# EAGLE schematic esp32_main_card (EAGLE 9.6.2)
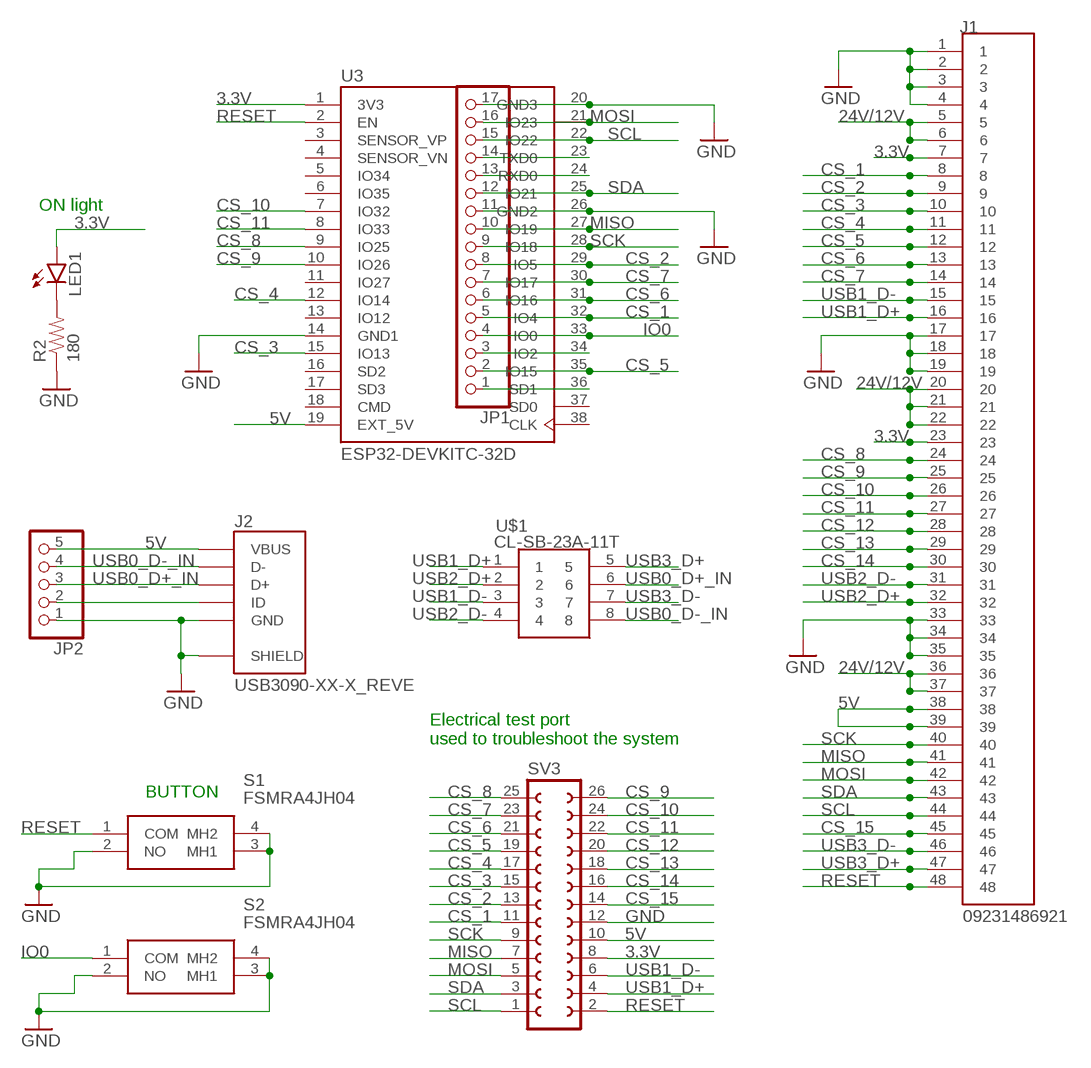
[diagram p0: schematic, sheet 1]

## Parts
J1  09231486921  [HARTING_09231486921]
J2  USB3090-XX-X_REVE  [GCT_USB3090-XX-X_REVE]
JP1  PINHD-1X17  [1X17]
JP2  PINHD-1X5  [1X05]
LED1  LED3MM  [LED3MM]
R2  180  RESISTOR0805-RES  [0805]
S1  FSMRA4JH04  [FSMRA4JH04]
S2  FSMRA4JH04  [FSMRA4JH04]
SV3  FE13-2W  [FE13-2W]
U3  ESP32-DEVKITC-32D  [MODULE_ESP32-DEVKITC-32D]
U$1  CL-SB-23A-11T  [CL-SB-23A-11T]

## Nets
3.3V: J1.7 J1.23 LED1.A SV3.8 U3.1(3V3)
5V: J1.38 J1.39 J2.1(VBUS) JP2.5 SV3.10 U3.19(EXT_5V)
24V/12V [POWER]: J1.5 J1.6 J1.20 J1.21 J1.22 J1.36 J1.37
CS_1: J1.8 JP1.5 SV3.11 U3.32(IO4)
CS_2: J1.9 JP1.8 SV3.13 U3.29(IO5)
CS_3: J1.10 SV3.15 U3.15(IO13)
CS_4: J1.11 SV3.17 U3.12(IO14)
CS_5: J1.12 JP1.2 SV3.19 U3.35(IO15)
CS_6: J1.13 JP1.6 SV3.21 U3.31(IO16)
CS_7: J1.14 JP1.7 SV3.23 U3.30(IO17)
CS_8: J1.24 SV3.25 U3.9(IO25)
CS_9: J1.25 SV3.26 U3.10(IO26)
CS_10: J1.26 SV3.24 U3.7(IO32)
CS_11: J1.27 SV3.22 U3.8(IO33)
CS_12: J1.28 SV3.20
CS_13: J1.29 SV3.18
CS_14: J1.30 SV3.16
CS_15: J1.45 SV3.14
GND: J1.1 J1.2 J1.3 J1.4 J1.17 J1.18 J1.19 J1.33 J1.34 J1.35 J2.5(GND) J2.6(SHIELD) J2.7(SHIELD) J2.8(SHIELD) J2.9(SHIELD) JP1.11 JP2.1 R2.1 S1.2(NO) S1.3(MH1) S1.4(MH2) S2.2(NO) S2.3(MH1) S2.4(MH2) SV3.12 U3.14(GND1) U3.26(GND2)
IO0: JP1.4 S2.1(COM) U3.33(IO0)
MISO: J1.41 JP1.10 SV3.7 U3.27(IO19)
MOSI: J1.42 JP1.16 SV3.5 U3.21(IO23)
N$1: J2.4(ID) JP2.2
N$2: JP1.17 U3.20(GND3) ; supply symbol labelled GND
N$3: JP1.14 U3.23(TXD0)
N$4: JP1.13 U3.24(RXD0)
N$6: JP1.3 U3.34(IO2)
N$7: JP1.1 U3.36(SD1)
N$9: LED1.K(C) R2.2
RESET: J1.48 S1.1(COM) SV3.2 U3.2(EN)
SCK: J1.40 JP1.9 SV3.9 U3.28(IO18)
SCL: J1.44 JP1.15 SV3.1 U3.22(IO22)
SDA: J1.43 JP1.12 SV3.3 U3.25(IO21)
USB0_D+_IN: J2.3(D+) JP2.3 U$1.6
USB0_D-_IN: J2.2(D-) JP2.4 U$1.8
USB1_D+: J1.16 SV3.4 U$1.1
USB1_D-: J1.15 SV3.6 U$1.3
USB2_D+: J1.32 U$1.2
USB2_D-: J1.31 U$1.4
USB3_D+: J1.47 U$1.5
USB3_D-: J1.46 U$1.7
Unconnected: U3.3(SENSOR_VP) U3.4(SENSOR_VN) U3.5(IO34) U3.6(IO35) U3.11(IO27) U3.13(IO12) U3.16(SD2) U3.17(SD3) U3.18(CMD) U3.37(SD0) U3.38(CLK)

## Notes on the sheet
- ON light
- Electrical test port
  used to troubleshoot the system
- BUTTON

## Library data of the parts
J1 = din41612_48_pin_board:09231486921: Check prices <https://pricing.snapeda.com/parts/8-1393644-0/TE%20Connectivity/view-part?ref=eda>; MANUFACTURER-PART-NUMBER: 09231486921; PACKAGE: None
J2 = USB3090-XX-X_REVE:USB3090-XX-X_REVE: Micro USB Receptacle, Type AB, SMT, R/A, Bottom Mount, w/out Peg, w/outer shell stakes Check prices <https://pricing.snapeda.com/parts/USB3090-30-A/Global%20Connector%20Technology/view-part?ref=eda>; MANUFACTURER-PART-NUMBER: USB3090-30-A; PACKAGE: None; SIMILAR-COMPONENTS: MCR-B-S-RA-SMT-CS5A-NF-T/R
JP1 = pinhead:PINHD-1X17: PIN HEADER; MANUFACTURER-PART-NUMBER: SLW-117-01-T-S; PACKAGE: 2.54 mm header; SIMILAR-COMPONENTS: https://www.adafruit.com/product/3008
JP2 = pinhead:PINHD-1X5: PIN HEADER
LED1 = led:LED: LED OSRAM: - CHIPLED LG R971, LG N971, LY N971, LG Q971, LY Q971, LO R971, LY R971 LH N974, LH R974 LS Q976, LO Q976, LY Q976 LO Q996 - Hyper CHIPLED LW Q18S LB Q993, LB Q99A, LB R99A - SideLED LS A670, LO A670, LY A670, LG A670, LP A670 LB A673, LV A673, LT A673, LW A673 LH A674 LY A675 LS A676, LA A676, LO A676, LY A676, LW A676 LS A679, LY A679, LG A679 - Hyper Micro SIDELED® LS Y876, LA Y876, LO Y876, LY Y876 LT Y87S - SmartLED LW L88C, LW L88S LB L89C, LB L89S, LG L890 LS L89K, LO L89K, LY L89K LS L896, LA L896, LO L896, LY L896 - TOPLED LS T670, LO T670, LY T670, LG T670, LP T670 LSG T670, LSP T670, LSY T670, LOP T670, LYG T670 LG T671, LOG T671, LSG T671 LB T673, LV T673, LT T673, LW T673 LH T674 LS T676, LA T676, LO T676, LY T676, LB T676, LH T676, LSB T676, LW T676 LB T67C, LV T67C, LT T67C, LS T67K, LO T67K, LY T67K, LW E67C LS E67B, LA E67B, LO E67B, LY E67B, LB E67C, LV E67C, LT E67C LW T67C LS T679, LY T679, LG T679 LS T770, LO T770, LY T770, LG T770, LP T770 LB T773, LV T773, LT T773, LW T773 LH T774 LS E675, LA E675, LY E675, LS T675 LS T776, LA T776, LO T776, LY T776, LB T776 LHGB T686 LT T68C, LB T68C - Hyper Mini TOPLED® LB M676 - Mini TOPLED Santana® LG M470 LS M47K, LO M47K, LY M47K Source: http://www.osram.convergy.de LUXEON: - LUMILED® LXK2-PW12-R00, LXK2-PW12-S00, LXK2-PW14-U00, LXK2-PW14-V00 LXK2-PM12-R00, LXK2-PM12-S00, LXK2-PM14-U00 LXK2-PE12-Q00, LXK2-PE12-R00, LXK2-PE12-S00, LXK2-PE14-T00, LXK2-PE14-U00 LXK2-PB12-K00, LXK2-PB12-L00, LXK2-PB12-M00, LXK2-PB14-N00, LXK2-PB14-P00, LXK2-PB14-Q00 LXK2-PR12-L00, LXK2-PR12-M00, LXK2-PR14-Q00, LXK2-PR14-R00 LXK2-PD12-Q00, LXK2-PD12-R00, LXK2-PD12-S00 LXK2-PH12-R00, LXK2-PH12-S00 LXK2-PL12-P00, LXK2-PL12-Q00, LXK2-PL12-R00 Source: www.luxeon.com KINGBRIGHT: KA-3528ASYC Source: www.kingbright.com; MANUFACTURER-PART-NUMBER: Generic green 3mm LED; PACKAGE: none
R2 = SparkFun-Passives:RESISTOR: Resistor Basic schematic elements and footprints for 0603, 1206, and PTH resistors.; MANUFACTURER-PART-NUMBER: Generic; PACKAGE: 0805; SIMILAR-COMPONENTS: Generic 0805 resistors
S1 S2 = FSMRA4JH04:FSMRA4JH04: Tactile Switch Through Hole Source: Datasheet <http://www.te.com/commerce/DocumentDelivery/DDEController?Action=showdoc&DocId=Customer Drawing1825027G4pdfEnglishENG_CD_1825027_G4.pdf1-1825027-1> Check prices <https://pricing.snapeda.com/parts/FSMRA4JH04/TE%20Connectivity/view-part?ref=eda>; MANUFACTURER-PART-NUMBER: FSMRA4JH04; PACKAGE: None
SV3 = con-lsta:FE13-2W: FEMALE HEADER; MANUFACTURER-PART-NUMBER: generic 13x2 right angle header, male or female; PACKAGE: 13x2 2.54mm header
U3 = ESP32-DEVKITC-32D:ESP32-DEVKITC-32D: Eval Board For Esp-Wroom-32 Check prices <https://pricing.snapeda.com/search/part/ESP32-DEVKITC-32D/?ref=eda>; MANUFACTURER-PART-NUMBER: ESP32-DEVKITC-32D, SLW-119-01-T-S < buy two of these; PACKAGE: None; SIMILAR-COMPONENTS: none, https://www.adafruit.com/product/3008
U$1 = CL-SB-23A-11T:CL-SB-23A-11T: Check prices <https://pricing.snapeda.com/parts/CL-SB-23A-11T/Nidec%20Copal%20Electronics/view-part?ref=eda>; MANUFACTURER-PART-NUMBER: CL-SB-23A-11T; PACKAGE: None

## Net classes
1 POWER: clearance 0.508 mm